# EAGLE schematic Traffic Light Controller Nano 2015 (EAGLE 7.2.0)
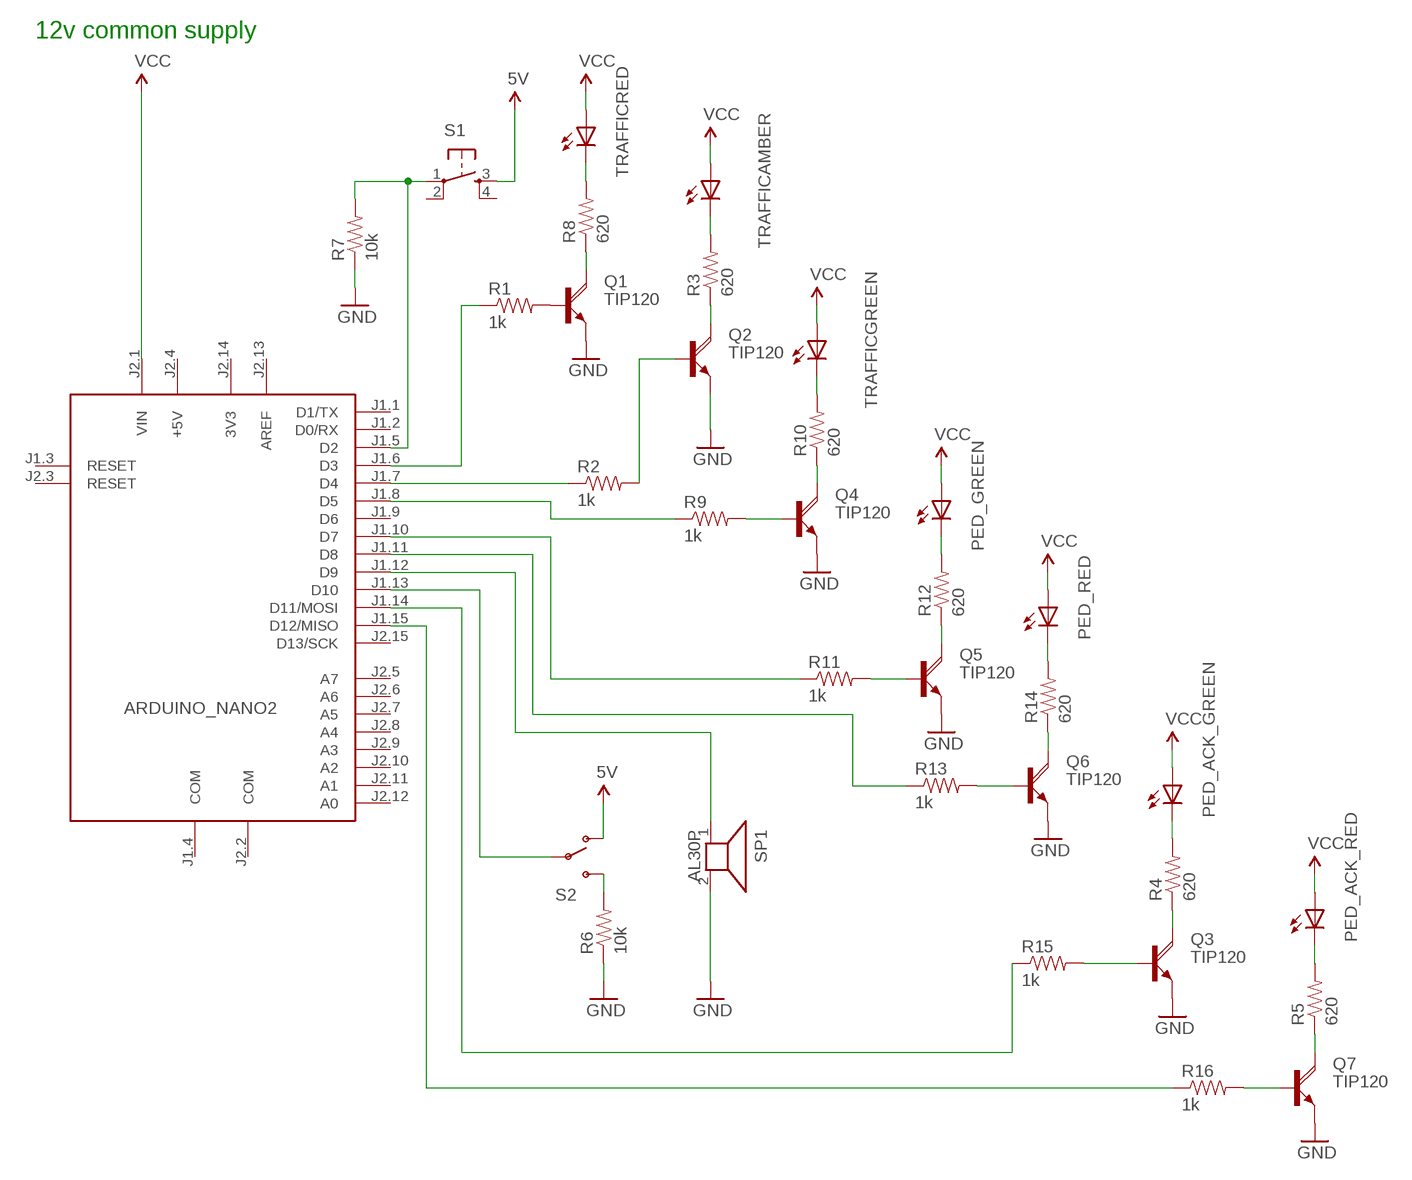
[diagram p0: schematic, sheet 1]

## Parts
MODUL1  ARDUINO_NANO2  [ARDUINO_NANO2]
PED_ACK_GREEN  LED5MM  [LED5MM]
PED_ACK_RED  LED5MM  [LED5MM]
PED_GREEN  LED5MM  [LED5MM]
PED_RED  LED5MM  [LED5MM]
Q1  TIP120  [TO220AH]
Q2  TIP120  [TO220AH]
Q3  TIP120  [TO220AH]
Q4  TIP120  [TO220AH]
Q5  TIP120  [TO220AH]
Q6  TIP120  [TO220AH]
Q7  TIP120  [TO220AH]
R1  1k  RESISTORPTH-1/4W  [AXIAL-0.4]
R2  1k  RESISTORPTH-1/4W  [AXIAL-0.4]
R3  620  RESISTORPTH-1/4W  [AXIAL-0.4]
R4  620  RESISTORPTH-1/4W  [AXIAL-0.4]
R5  620  RESISTORPTH-1/4W  [AXIAL-0.4]
R6  10k  RESISTORPTH-1/4W  [AXIAL-0.4]
R7  10k  RESISTORPTH-1/4W  [AXIAL-0.4]
R8  620  RESISTORPTH-1/4W  [AXIAL-0.4]
R9  1k  RESISTORPTH-1/4W  [AXIAL-0.4]
R10  620  RESISTORPTH-1/4W  [AXIAL-0.4]
R11  1k  RESISTORPTH-1/4W  [AXIAL-0.4]
R12  620  RESISTORPTH-1/4W  [AXIAL-0.4]
R13  1k  RESISTORPTH-1/4W  [AXIAL-0.4]
R14  620  RESISTORPTH-1/4W  [AXIAL-0.4]
R15  1k  RESISTORPTH-1/4W  [AXIAL-0.4]
R16  1k  RESISTORPTH-1/4W  [AXIAL-0.4]
S1  TAC_SWITCHPTH  [TACTILE-PTH]
S2  SWITCH-SPDTKIT  [SWITCH-SPDT_KIT]
SP1  AL30P  [AL30P]
TRAFFICAMBER  LED5MM  [LED5MM]
TRAFFICGREEN  LED5MM  [LED5MM]
TRAFFICRED  LED5MM  [LED5MM]

## Nets
5V: S1.3 S2.1(O)
GND: Q1.E Q2.E Q3.E Q4.E Q5.E Q6.E Q7.E R6.P$1 R7.P$1 SP1.2
N$1: Q1.B R1.P$2
N$2: Q2.B R2.P$2
N$3: R3.P$2 TRAFFICAMBER.K(C)
N$4: Q2.C R3.P$1
N$5: MODUL1.J1.6(D3) R1.P$1
N$6: R8.P$2 TRAFFICRED.K(C)
N$7: Q1.C R8.P$1
N$8: MODUL1.J1.7(D4) R2.P$1
N$9: MODUL1.J1.12(D9) SP1.1
N$10: MODUL1.J1.13(D10) S2.2(P)
N$11: MODUL1.J1.5(D2) R7.P$2 S1.1
N$12: Q4.B R9.P$2
N$13: R10.P$2 TRAFFICGREEN.K(C)
N$14: Q4.C R10.P$1
N$15: MODUL1.J1.8(D5) R9.P$1
N$16: Q5.B R11.P$2
N$17: PED_GREEN.K(C) R12.P$2
N$18: Q5.C R12.P$1
N$19: Q6.B R13.P$2
N$20: PED_RED.K(C) R14.P$2
N$21: Q6.C R14.P$1
N$22: MODUL1.J1.10(D7) R11.P$1
N$23: MODUL1.J1.11(D8) R13.P$1
N$24: Q3.B R15.P$2
N$25: R6.P$2 S2.3(S)
N$26: PED_ACK_GREEN.K(C) R4.P$2
N$27: Q7.B R16.P$2
N$28: MODUL1.J1.15(D12/MISO) R16.P$1
N$29: Q3.C R4.P$1
N$30: PED_ACK_RED.K(C) R5.P$2
N$31: Q7.C R5.P$1
N$32: MODUL1.J1.14(D11/MOSI) R15.P$1
VCC: MODUL1.J2.1(VIN) PED_ACK_GREEN.A PED_ACK_RED.A PED_GREEN.A PED_RED.A TRAFFICAMBER.A TRAFFICGREEN.A TRAFFICRED.A
Unconnected: MODUL1.J1.1(D1/TX) MODUL1.J1.2(D0/RX) MODUL1.J1.3(RESET) MODUL1.J1.9(D6) MODUL1.J2.3(RESET) MODUL1.J2.5(A7) MODUL1.J2.6(A6) MODUL1.J2.7(A5) MODUL1.J2.8(A4) MODUL1.J2.9(A3) MODUL1.J2.10(A2) MODUL1.J2.11(A1) MODUL1.J2.12(A0) MODUL1.J2.15(D13/SCK) S1.2 S1.4

## Notes on the sheet
- 12v common supply

## Power pins joined to a net without a drawn wire
3V3: MODUL1.J2.14(3V3)
+5V: MODUL1.J2.4(+5V)
AREF: MODUL1.J2.13(AREF)
COM: MODUL1.J1.4(COM) MODUL1.J2.2(COM)

## Library data of the parts
MODUL1 = arduino:ARDUINO_NANO2: Arduino Nano2 Auto generated by modulcreator.ulp \;; ANZAHL: 2; MODUL: TRUE; STECKX0: -76200; STECKX1: 76200; STECKY0: 177800; STECKY1: 177800
PED_ACK_GREEN PED_ACK_RED PED_GREEN PED_RED TRAFFICAMBER TRAFFICGREEN TRAFFICRED = adafruit:LED: LED OSRAM: - CHIPLED LG R971, LG N971, LY N971, LG Q971, LY Q971, LO R971, LY R971 LH N974, LH R974 LS Q976, LO Q976, LY Q976 LO Q996 - Hyper CHIPLED LW Q18S LB Q993, LB Q99A, LB R99A - SideLED LS A670, LO A670, LY A670, LG A670, LP A670 LB A673, LV A673, LT A673, LW A673 LH A674 LY A675 LS A676, LA A676, LO A676, LY A676, LW A676 LS A679, LY A679, LG A679 - Hyper Micro SIDELED® LS Y876, LA Y876, LO Y876, LY Y876 LT Y87S - SmartLED LW L88C, LW L88S LB L89C, LB L89S, LG L890 LS L89K, LO L89K, LY L89K LS L896, LA L896, LO L896, LY L896 - TOPLED LS T670, LO T670, LY T670, LG T670, LP T670 LSG T670, LSP T670, LSY T670, LOP T670, LYG T670 LG T671, LOG T671, LSG T671 LB T673, LV T673, LT T673, LW T673 LH T674 LS T676, LA T676, LO T676, LY T676, LB T676, LH T676, LSB T676, LW T676 LB T67C, LV T67C, LT T67C, LS T67K, LO T67K, LY T67K, LW E67C LS E67B, LA E67B, LO E67B, LY E67B, LB E67C, LV E67C, LT E67C LW T67C LS T679, LY T679, LG T679 LS T770, LO T770, LY T770, LG T770, LP T770 LB T773, LV T773, LT T773, LW T773 LH T774 LS E675, LA E675, LY E675, LS T675 LS T776, LA T776, LO T776, LY T776, LB T776 LHGB T686 LT T68C, LB T68C - Hyper Mini TOPLED® LB M676 - Mini TOPLED Santana® LG M470 LS M47K, LO M47K, LY M47K Source: http://www.osram.convergy.de/
Q1-Q7 = transistor-power:TIP120: NPN DARLINGTON TRANSISTOR
R1-R16 = SparkFun-Resistors:RESISTOR: Resistor Basic schematic elements and footprints for 0603, 1206, and PTH resistors.
S1 = SparkFun-Electromechanical:TAC_SWITCH: Momentary Switch Button commonly used for reset or general input. Spark Fun Electronics SKU : COM-00097 SMT- SWCH-08247
S2 = SparkFun-Electromechanical:SWITCH-SPDT: SPDT Switch Simple slide switch, Spark Fun Electronics SKU : COM-00102 DPDT SMT slide switch, AYZ0202, SWCH-08179; PROD_ID: SWCH-08261
SP1 = buzzer:AL30P: SPEAKER Source: Buerklin; OC_FARNELL: unknown; OC_NEWARK: unknown